# EAGLE design vera-module (EAGLE 7.7.0)

## Sheet 1 of 2
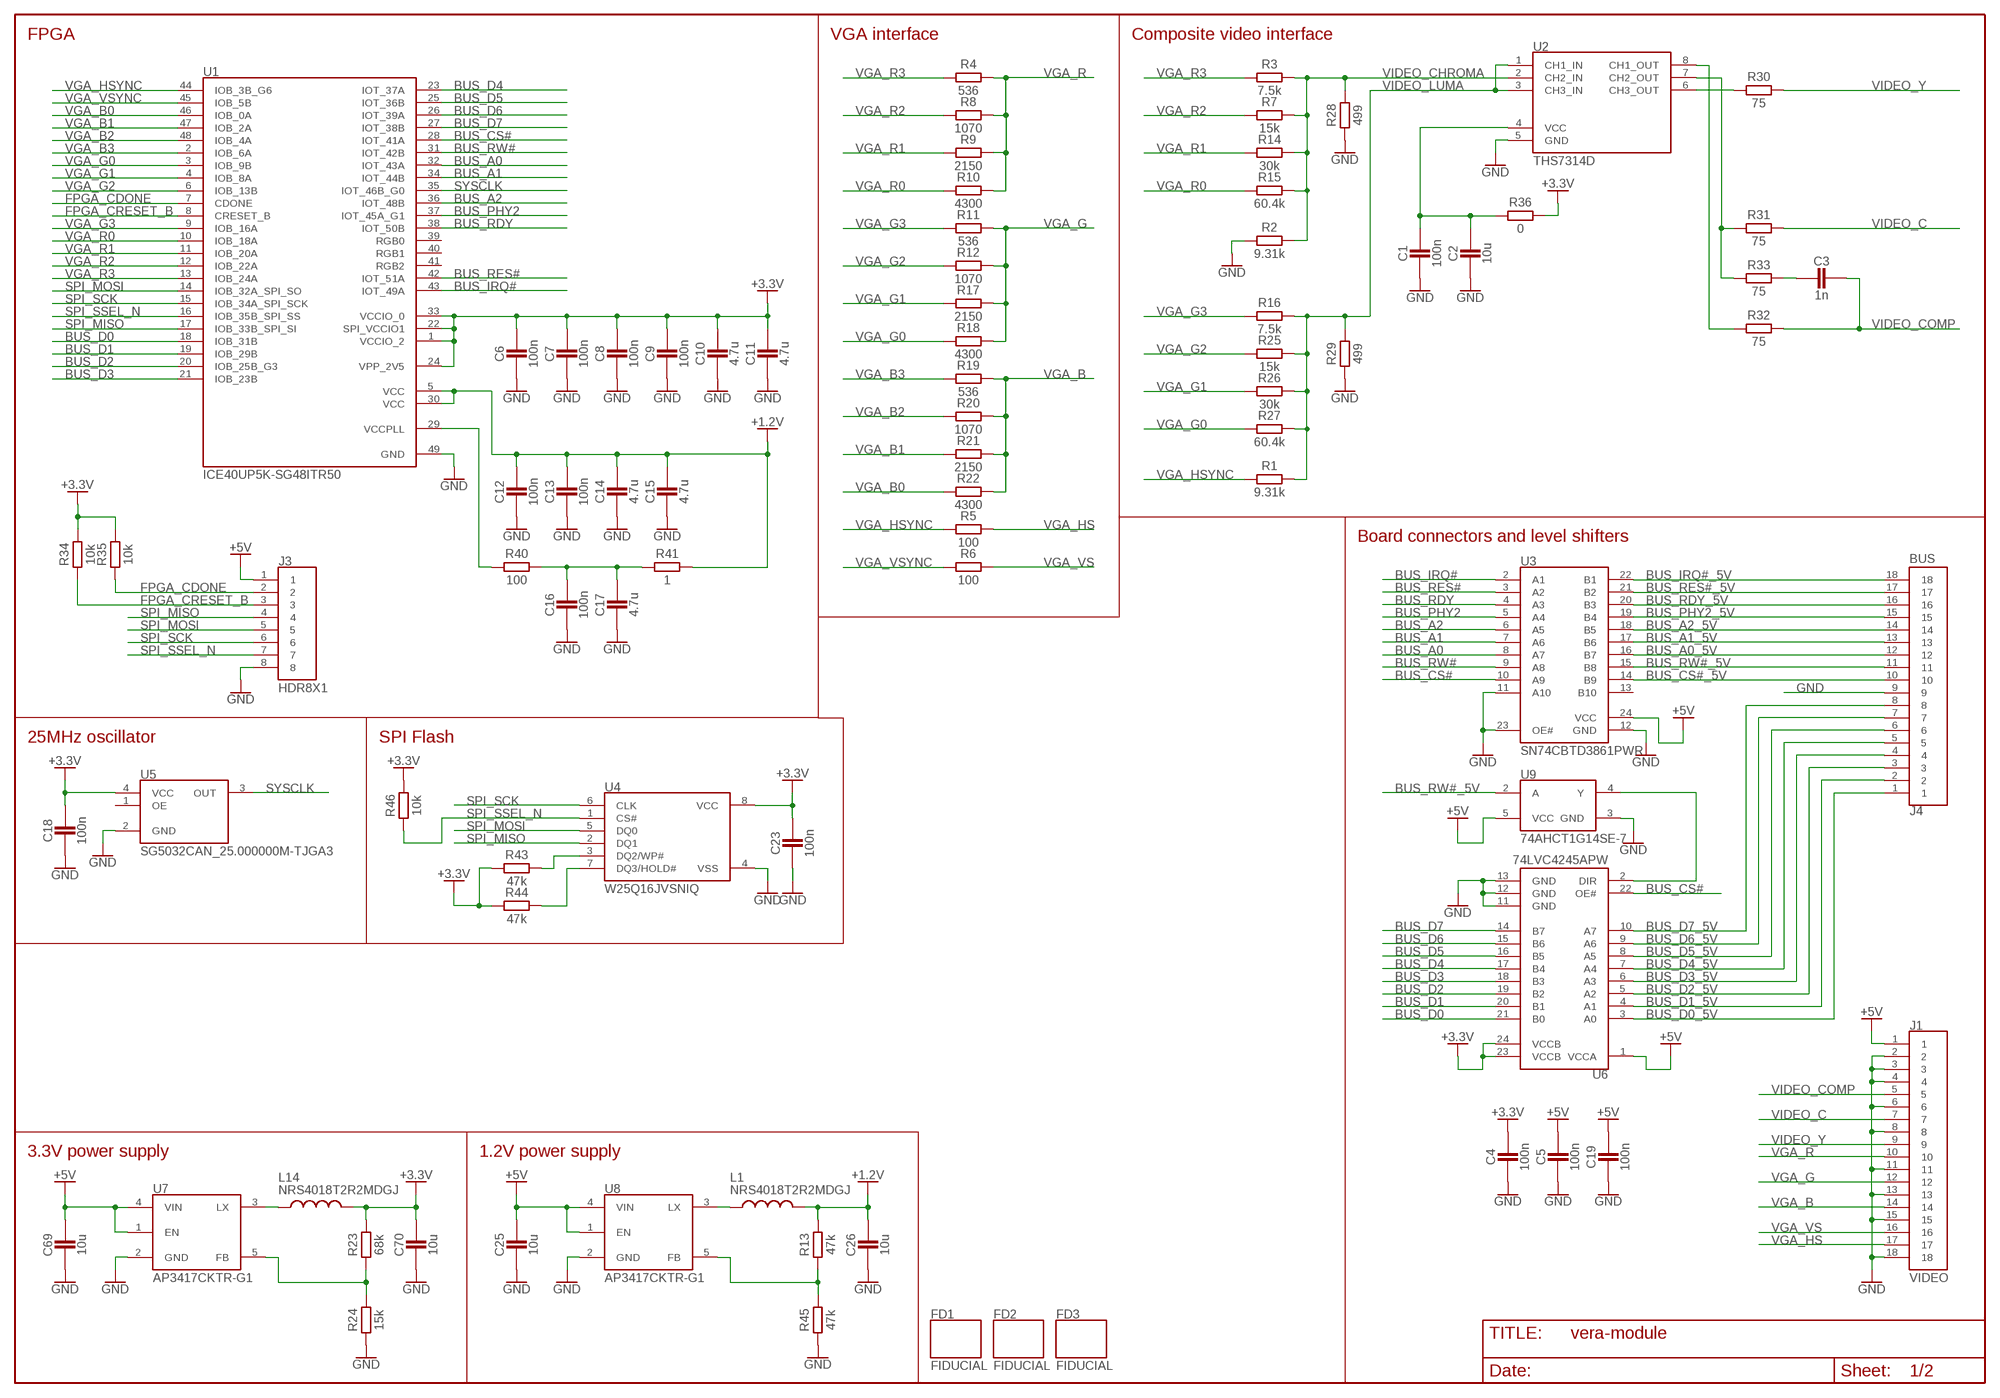
[diagram p0: schematic, sheet 1]

### Parts
C1  100n  CAPACITOR0603  [C0603]
C2  10u  CAPACITOR0805  [C0805]
C3  1n  CAPACITOR0603  [C0603]
C4  100n  CAPACITOR0603  [C0603]
C5  100n  CAPACITOR0603  [C0603]
C6  100n  CAPACITOR0603  [C0603]
C7  100n  CAPACITOR0603  [C0603]
C8  100n  CAPACITOR0603  [C0603]
C9  100n  CAPACITOR0603  [C0603]
C10  4.7u  CAPACITOR0603  [C0603]
C11  4.7u  CAPACITOR0603  [C0603]
C12  100n  CAPACITOR0603  [C0603]
C13  100n  CAPACITOR0603  [C0603]
C14  4.7u  CAPACITOR0603  [C0603]
C15  4.7u  CAPACITOR0603  [C0603]
C16  100n  CAPACITOR0603  [C0603]
C17  4.7u  CAPACITOR0603  [C0603]
C18  100n  CAPACITOR0603  [C0603]
C19  100n  CAPACITOR0603  [C0603]
C23  100n  CAPACITOR0603  [C0603]
C25  10u  CAPACITOR0805  [C0805]
C26  10u  CAPACITOR0805  [C0805]
C69  10u  CAPACITOR0805  [C0805]
C70  10u  CAPACITOR0805  [C0805]
FD1  FIDUCIAL  [FIDUCIAL]
FD2  FIDUCIAL  [FIDUCIAL]
FD3  FIDUCIAL  [FIDUCIAL]
J1  VIDEO  HDR18X1  [HDR18X1]
J3  HDR8X1  [HDR8X1]
J4  BUS  HDR18X1  [HDR18X1]
L1  NRS4018T2R2MDGJ  INDUCTORNRS4018  [NRS4018]
L14  NRS4018T2R2MDGJ  INDUCTORNRS4018  [NRS4018]
R1  9.31k  RESISTOR0603  [R0603]
R2  9.31k  RESISTOR0603  [R0603]
R3  7.5k  RESISTOR0603  [R0603]
R4  536  RESISTOR0603  [R0603]
R5  100  RESISTOR0603  [R0603]
R6  100  RESISTOR0603  [R0603]
R7  15k  RESISTOR0603  [R0603]
R8  1070  RESISTOR0603  [R0603]
R9  2150  RESISTOR0603  [R0603]
R10  4300  RESISTOR0603  [R0603]
R11  536  RESISTOR0603  [R0603]
R12  1070  RESISTOR0603  [R0603]
R13  47k  RESISTOR0603  [R0603]
R14  30k  RESISTOR0603  [R0603]
R15  60.4k  RESISTOR0603  [R0603]
R16  7.5k  RESISTOR0603  [R0603]
R17  2150  RESISTOR0603  [R0603]
R18  4300  RESISTOR0603  [R0603]
R19  536  RESISTOR0603  [R0603]
R20  1070  RESISTOR0603  [R0603]
R21  2150  RESISTOR0603  [R0603]
R22  4300  RESISTOR0603  [R0603]
R23  68k  RESISTOR0603  [R0603]
R24  15k  RESISTOR0603  [R0603]
R25  15k  RESISTOR0603  [R0603]
R26  30k  RESISTOR0603  [R0603]
R27  60.4k  RESISTOR0603  [R0603]
R28  499  RESISTOR0603  [R0603]
R29  499  RESISTOR0603  [R0603]
R30  75  RESISTOR0603  [R0603]
R31  75  RESISTOR0603  [R0603]
R32  75  RESISTOR0603  [R0603]
R33  75  RESISTOR0603  [R0603]
R34  10k  RESISTOR0603  [R0603]
R35  10k  RESISTOR0603  [R0603]
R36  0  RESISTOR0603  [R0603]
R40  100  RESISTOR0603  [R0603]
R41  1  RESISTOR0603  [R0603]
R43  47k  RESISTOR0603  [R0603]
R44  47k  RESISTOR0603  [R0603]
R45  47k  RESISTOR0603  [R0603]
R46  10k  RESISTOR0603  [R0603]
U1  ICE40UP5K-SG48ITR50  [QFN-48]
U2  THS7314D  [SOIC-8]
U3  SN74CBTD3861PWR  [TSSOP-24]
U4  W25Q16JVSNIQ  QSPI_FLASHSOIC8  [SOIC-8]
U5  SG5032CAN_25.000000M-TJGA3  SG5032CAN_40.000000M-TJGA3  [SG5032]
U6  74LVC4245APW  [TSSOP-24]
U7  AP3417CKTR-G1  [SOT-23-5]
U8  AP3417CKTR-G1  [SOT-23-5]
U9  74AHCT1G14SE-7  [TSSOP-5]

### Nets
+1.2V: C12.2 C13.2 C14.2 C15.2 C26.2 L1.2 R13.2 R41.2 U1.5(VCC) U1.30(VCC)
+3.3V: C4.2 C6.2 C7.2 C8.2 C9.2 C10.2 C11.2 C18.2 C23.2 C70.2 L14.2 R23.2 R34.1 R35.1 R36.2 R43.1 R44.1 R46.1 U1.1(VCCIO_2) U1.22(SPI_VCCIO1) U1.24(VPP_2V5) U1.33(VCCIO_0) U4.8(VCC) U5.4(VCC) U6.23(VCCB) U6.24(VCCB)
+5V [5V]: C5.2 C19.2 C25.2 C69.2 J1.1 J3.1 U3.24(VCC) U6.1(VCCA) U7.1(EN) U7.4(VIN) U8.1(EN) U8.4(VIN) U9.5(VCC) ; also sheet 2
BUS_A0: U1.32(IOT_43A) U3.8(A7)
BUS_A0_5V: J4.12 U3.16(B7)
BUS_A1: U1.34(IOT_44B) U3.7(A6)
BUS_A1_5V: J4.13 U3.17(B6)
BUS_A2: U1.36(IOT_48B) U3.6(A5)
BUS_A2_5V: J4.14 U3.18(B5)
BUS_CS#: U1.28(IOT_41A) U3.10(A9) U6.22(OE#)
BUS_CS#_5V: J4.10 U3.14(B9)
BUS_D0: U1.18(IOB_31B) U6.21(B0)
BUS_D0_5V: J4.1 U6.3(A0)
BUS_D1: U1.19(IOB_29B) U6.20(B1)
BUS_D1_5V: J4.2 U6.4(A1)
BUS_D2: U1.20(IOB_25B_G3) U6.19(B2)
BUS_D2_5V: J4.3 U6.5(A2)
BUS_D3: U1.21(IOB_23B) U6.18(B3)
BUS_D3_5V: J4.4 U6.6(A3)
BUS_D4: U1.23(IOT_37A) U6.17(B4)
BUS_D4_5V: J4.5 U6.7(A4)
BUS_D5: U1.25(IOT_36B) U6.16(B5)
BUS_D5_5V: J4.6 U6.8(A5)
BUS_D6: U1.26(IOT_39A) U6.15(B6)
BUS_D6_5V: J4.7 U6.9(A6)
BUS_D7: U1.27(IOT_38B) U6.14(B7)
BUS_D7_5V: J4.8 U6.10(A7)
BUS_IRQ#: U1.43(IOT_49A) U3.2(A1)
BUS_IRQ#_5V: J4.18 U3.22(B1)
BUS_PHY2: U1.37(IOT_45A_G1) U3.5(A4)
BUS_PHY2_5V: J4.15 U3.19(B4)
BUS_RDY: U1.38(IOT_50B) U3.4(A3)
BUS_RDY_5V: J4.16 U3.20(B3)
BUS_RES#: U1.42(IOT_51A) U3.3(A2)
BUS_RES#_5V: J4.17 U3.21(B2)
BUS_RW#: U1.31(IOT_42B) U3.9(A8)
BUS_RW#_5V: J4.11 U3.15(B8) U9.2(A)
FPGA_CDONE: J3.2 R35.2 U1.7(CDONE) ; also sheet 2
FPGA_CRESET_B: J3.3 R34.2 U1.8(CRESET_B) ; also sheet 2
GND: C1.1 C2.1 C4.1 C5.1 C6.1 C7.1 C8.1 C9.1 C10.1 C11.1 C12.1 C13.1 C14.1 C15.1 C16.1 C17.1 C18.1 C19.1 C23.1 C25.1 C26.1 C69.1 C70.1 J1.2 J1.3 J1.4 J1.6 J1.8 J1.11 J1.13 J1.15 J1.18 J3.8 J4.9 R2.1 R24.1 R28.2 R29.2 R45.1 U1.49(GND) U2.5(GND) U3.11(A10) U3.12(GND) U3.23(OE#) U4.4(VSS) U5.2(GND) U6.11(GND) U6.12(GND) U6.13(GND) U7.2(GND) U8.2(GND) U9.3(GND) ; also sheet 2
N$1: R30.1 U2.6(CH3_OUT)
N$2: R31.1 R33.1 U2.7(CH2_OUT)
N$4: R32.1 U2.8(CH1_OUT)
N$6: C3.1 R33.2
N$7: R23.1 R24.2 U7.5(FB)
N$8: U6.2(DIR) U9.4(Y)
N$9: C16.2 C17.2 R40.2 R41.1
N$14: R43.2 U4.3(DQ2/WP#)
N$15: R13.1 R45.2 U8.5(FB)
N$19: R44.2 U4.7(DQ3/HOLD#)
N$20: L1.1 U8.3(LX)
N$23: L14.1 U7.3(LX)
N$29: C1.2 C2.2 R36.1 U2.4(VCC)
N$44: R40.1 U1.29(VCCPLL)
SPI_MISO: J3.4 U1.17(IOB_33B_SPI_SI) U4.2(DQ1) ; also sheet 2
SPI_MOSI: J3.5 U1.14(IOB_32A_SPI_SO) U4.5(DQ0) ; also sheet 2
SPI_SCK: J3.6 U1.15(IOB_34A_SPI_SCK) U4.6(CLK) ; also sheet 2
SPI_SSEL_N: J3.7 R46.2 U1.16(IOB_35B_SPI_SS) U4.1(CS#) ; also sheet 2
SYSCLK: U1.35(IOT_46B_G0) U5.3(OUT)
VGA_B: J1.14 R19.2 R20.2 R21.2 R22.2
VGA_B0: R22.1 U1.46(IOB_0A)
VGA_B1: R21.1 U1.47(IOB_2A)
VGA_B2: R20.1 U1.48(IOB_4A)
VGA_B3: R19.1 U1.2(IOB_6A)
VGA_G: J1.12 R11.2 R12.2 R17.2 R18.2
VGA_G0: R18.1 R27.1 U1.3(IOB_9B)
VGA_G1: R17.1 R26.1 U1.4(IOB_8A)
VGA_G2: R12.1 R25.1 U1.6(IOB_13B)
VGA_G3: R11.1 R16.1 U1.9(IOB_16A)
VGA_HS: J1.17 R5.2
VGA_HSYNC: R1.1 R5.1 U1.44(IOB_3B_G6)
VGA_R: J1.10 R4.2 R8.2 R9.2 R10.2
VGA_R0: R10.1 R15.1 U1.10(IOB_18A)
VGA_R1: R9.1 R14.1 U1.11(IOB_20A)
VGA_R2: R7.1 R8.1 U1.12(IOB_22A)
VGA_R3: R3.1 R4.1 U1.13(IOB_24A)
VGA_VS: J1.16 R6.2
VGA_VSYNC: R6.1 U1.45(IOB_5B)
VIDEO_C: J1.7 R31.2
VIDEO_CHROMA: R2.2 R3.2 R7.2 R14.2 R15.2 R28.1 U2.2(CH2_IN)
VIDEO_COMP: C3.2 J1.5 R32.2
VIDEO_LUMA: R1.2 R16.2 R25.2 R26.2 R27.2 R29.1 U2.1(CH1_IN) U2.3(CH3_IN)
VIDEO_Y: J1.9 R30.2
Unconnected: U1.39(RGB0) U1.40(RGB1) U1.41(RGB2) U3.13(B10) U5.1(OE)

### Notes on the sheet
- FPGA | VGA interface | Composite video interface
- Board connectors and level shifters
- 25MHz oscillator | SPI Flash
- 3.3V power supply | 1.2V power supply

## Sheet 2 of 2
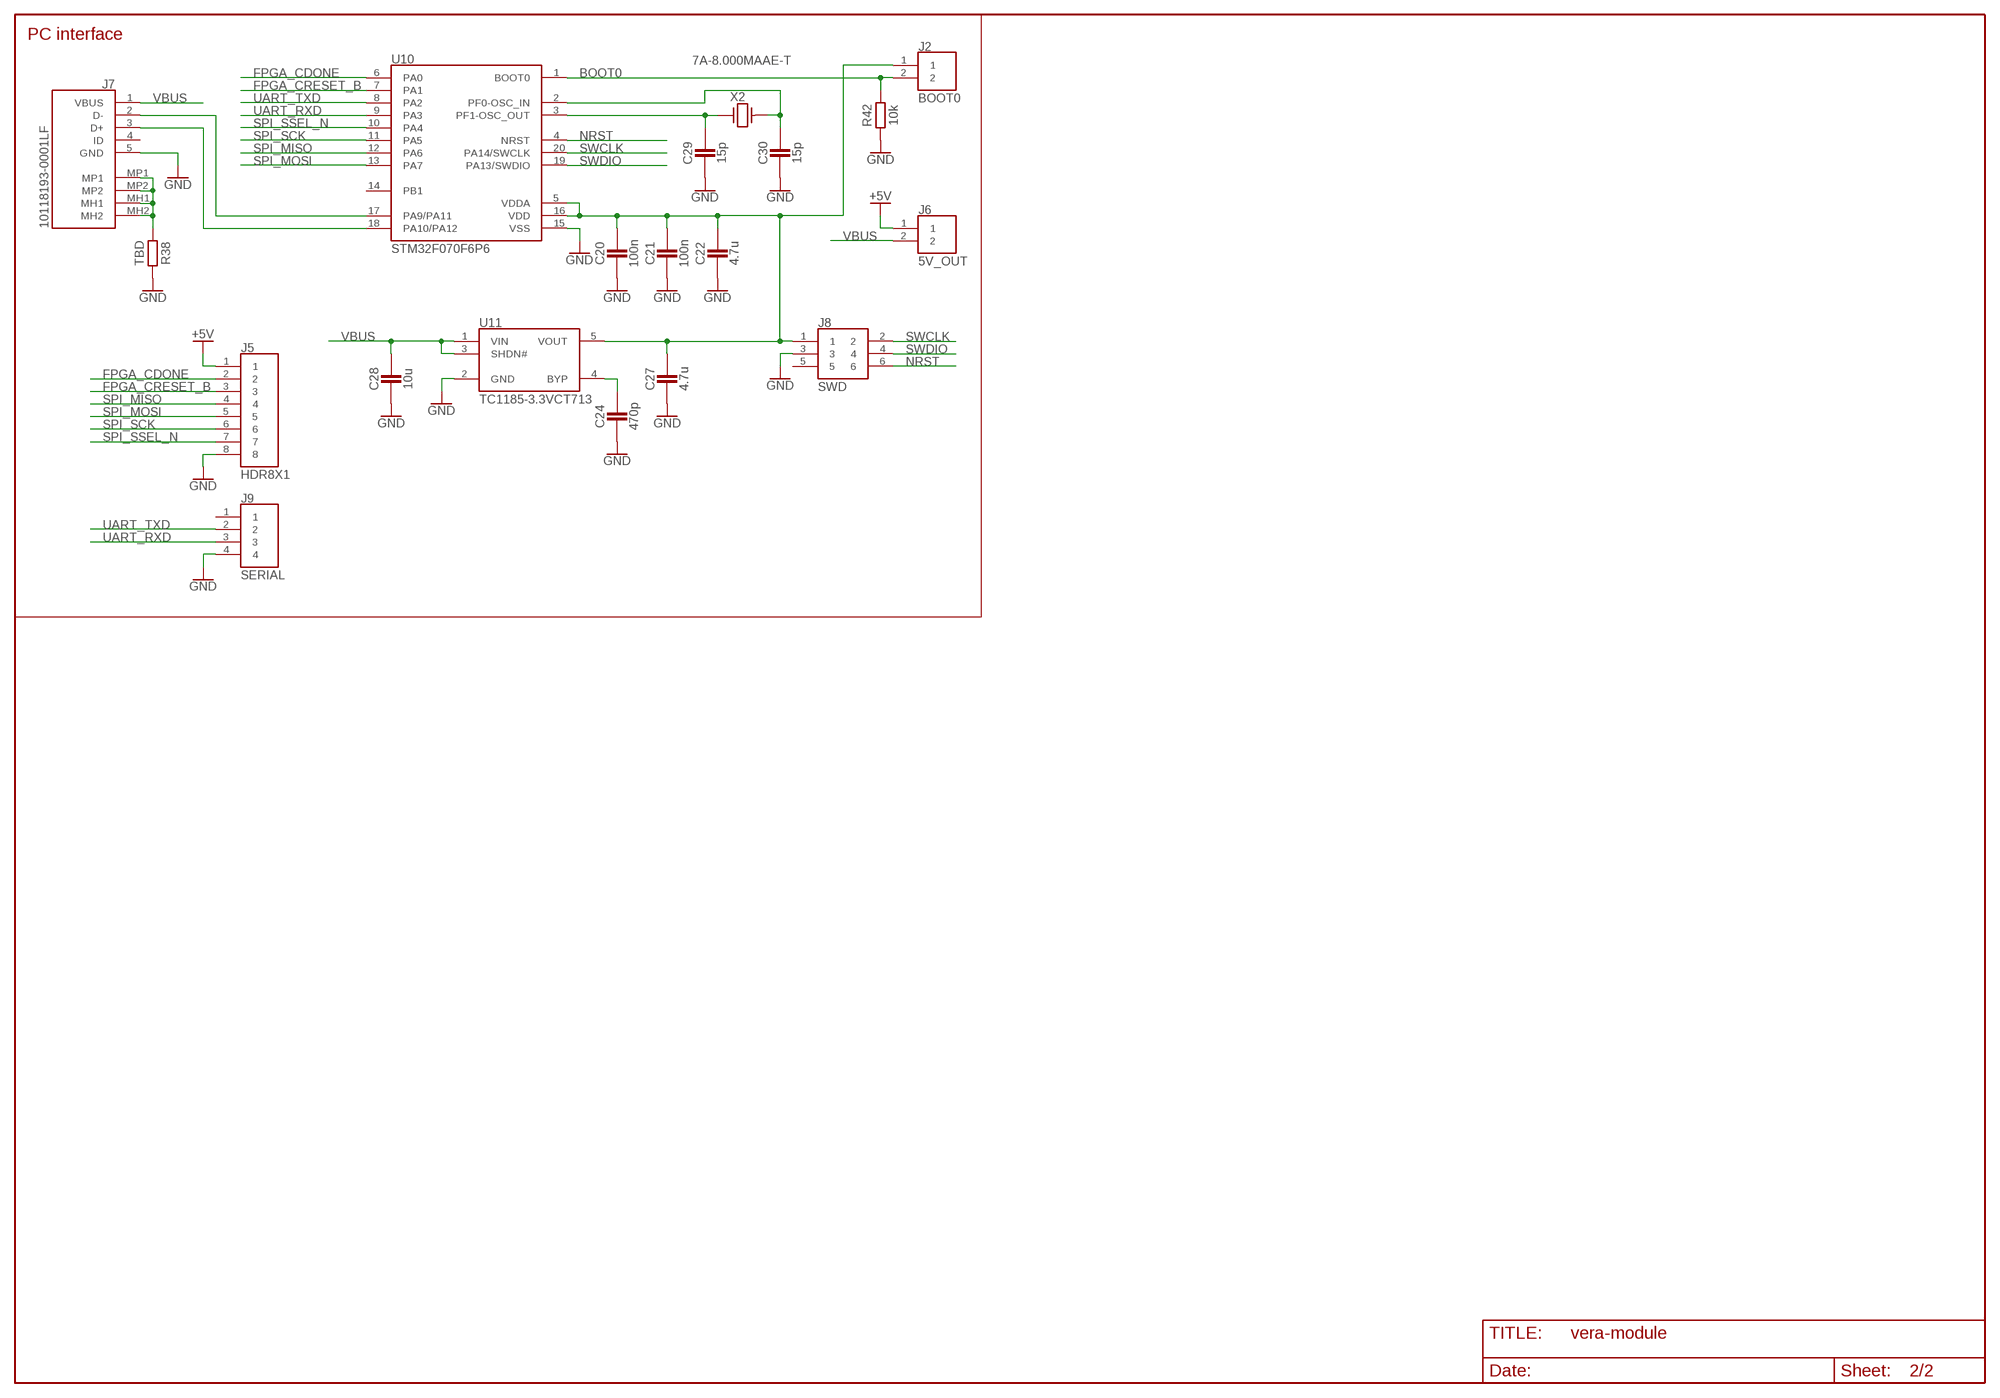
[diagram p1: schematic, sheet 2]

### Parts
C20  100n  CAPACITOR0603  [C0603]
C21  100n  CAPACITOR0603  [C0603]
C22  4.7u  CAPACITOR0603  [C0603]
C24  470p  CAPACITOR0603  [C0603]
C27  4.7u  CAPACITOR0603  [C0603]
C28  10u  CAPACITOR0805  [C0805]
C29  15p  CAPACITOR0603  [C0603]
C30  15p  CAPACITOR0603  [C0603]
J2  BOOT0  HDR2X1  [HDR2X1]
J5  HDR8X1  [HDR8X1]
J6  5V_OUT  HDR2X1  [HDR2X1]
J7  10118193-0001LF  [10118193-0001LF]
J8  SWD  HDR2X3  [HDR2X3]
J9  SERIAL  HDR4X1  [HDR4X1]
R38  TBD  RESISTOR0603  [R0603]
R42  10k  RESISTOR0603  [R0603]
U10  STM32F070F6P6  [TSSOP-20]
U11  TC1185-3.3VCT713  [SOT-23-5]
X2  7A-8.000MAAE-T  XTAL2_5X3.2  [XTAL2_5X3.2]

### Nets
+5V [5V]: J5.1 J6.1 ; also sheet 1
BOOT0: J2.2 R42.2 U10.1(BOOT0)
FPGA_CDONE: J5.2 U10.6(PA0) ; also sheet 1
FPGA_CRESET_B: J5.3 U10.7(PA1) ; also sheet 1
GND: C20.1 C21.1 C22.1 C24.1 C27.1 C28.1 C29.1 C30.1 J5.8 J7.5(GND) J8.3 J9.4 R38.1 R42.1 U10.15(VSS) U11.2(GND) ; also sheet 1
N$3: C29.2 U10.3(PF1-OSC_OUT) X2.1
N$5: C20.2 C21.2 C22.2 C27.2 J2.1 J8.1 U10.5(VDDA) U10.16(VDD) U11.5(VOUT)
N$10: C24.2 U11.4(BYP)
N$11: C30.2 U10.2(PF0-OSC_IN) X2.2
N$12: J7.2(D-) U10.17(PA9/PA11)
N$13: J7.3(D+) U10.18(PA10/PA12)
N$48: J7.MH1 J7.MH2 J7.MP1 J7.MP2 R38.2
NRST: J8.6 U10.4(NRST)
SPI_MISO: J5.4 U10.12(PA6) ; also sheet 1
SPI_MOSI: J5.5 U10.13(PA7) ; also sheet 1
SPI_SCK: J5.6 U10.11(PA5) ; also sheet 1
SPI_SSEL_N: J5.7 U10.10(PA4) ; also sheet 1
SWCLK: J8.2 U10.20(PA14/SWCLK)
SWDIO: J8.4 U10.19(PA13/SWDIO)
UART_RXD: J9.3 U10.9(PA3)
UART_TXD: J9.2 U10.8(PA2)
VBUS [5V]: C28.2 J6.2 J7.1(VBUS) U11.1(VIN) U11.3(SHDN#)
Unconnected: J7.4(ID) J8.5 J9.1 U10.14(PB1)

### Notes on the sheet
- PC interface

## Library data of the parts
C1-C30 C69 C70 = rcl:CAPACITOR
FD1-FD3 = misc:FIDUCIAL
J1 J4 = connectors:HDR18X1
J2 J6 = connectors:HDR2X1
J3 J5 = connectors:HDR8X1
J7 = connectors:10118193-0001LF
J8 = connectors:HDR2X3
J9 = connectors:HDR4X1
L1 L14 = rcl:INDUCTOR
R1-R36 R38 R40-R46 = rcl:RESISTOR
U1 = integrated_circuits:ICE40UP5K-SG48ITR50: Lattice ICE40 5K LE FPGA
U2 = integrated_circuits:THS7314D
U3 = integrated_circuits:SN74CBTD3861PWR
U4 = integrated_circuits:QSPI_FLASH
U5 = integrated_circuits:SG5032CAN_40.000000M-TJGA3: Epson 40 MHz 3.3V Oscillator +/- 50ppm
U6 = integrated_circuits:74LVC4245APW
U7 U8 = integrated_circuits:AP3417CKTR-G1
U9 = integrated_circuits:74AHCT1G14SE-7
U10 = integrated_circuits:STM32F070F6P6: ARM Cortex M0 with USB 32KB Flash, 6KB RAM
U11 = integrated_circuits:TC1185-3.3VCT713
X2 = crystals:XTAL2_5X3.2

## Net classes
1 5V: clearance 0.2 mm

## Board
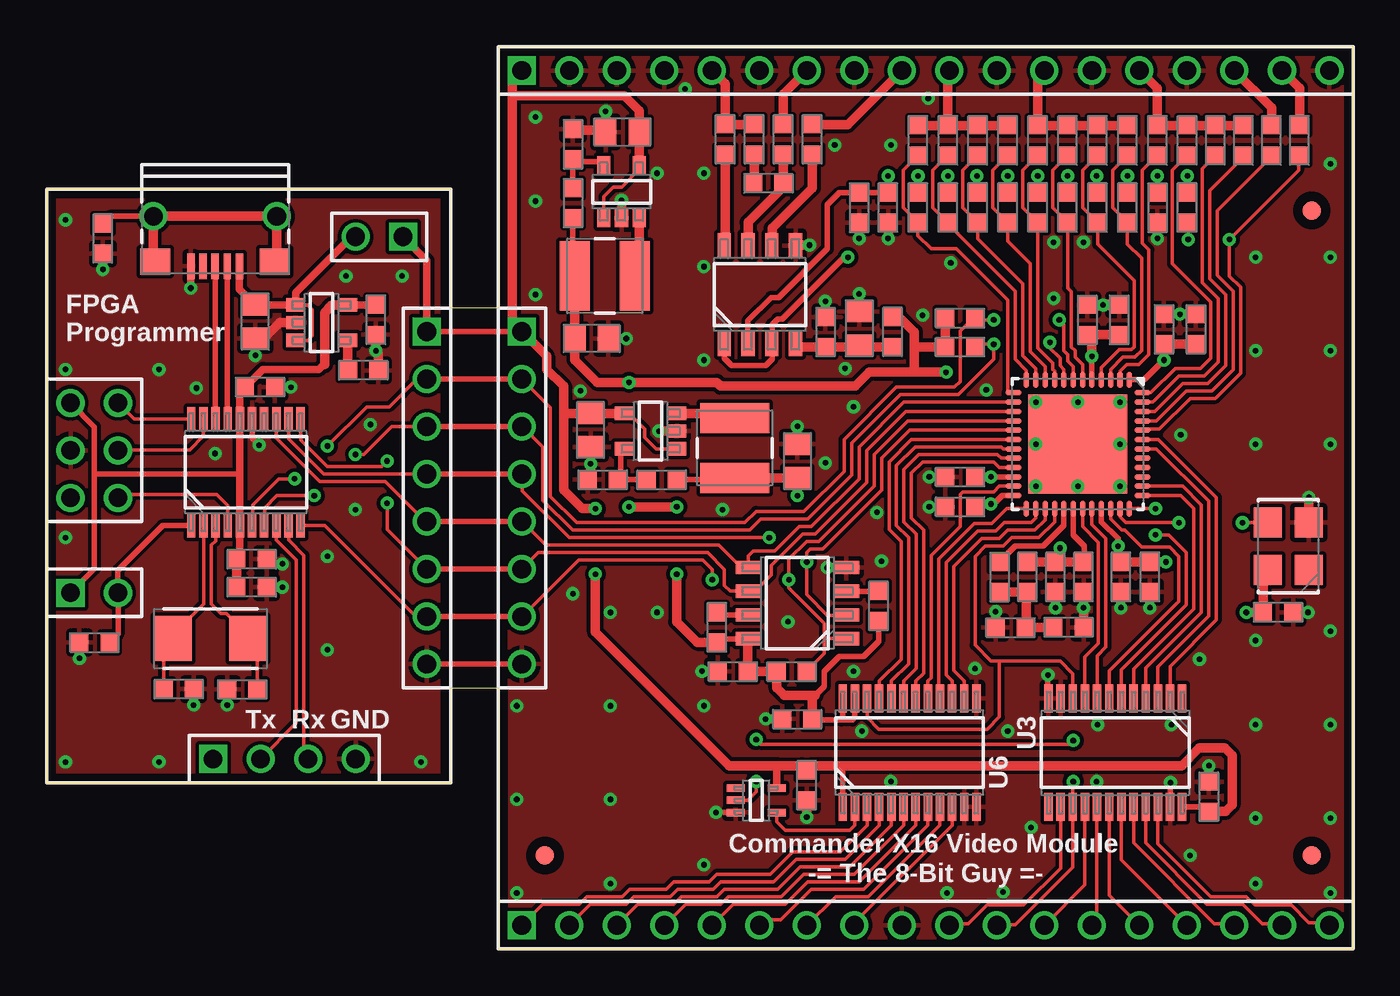
[diagram p2: board, top side]
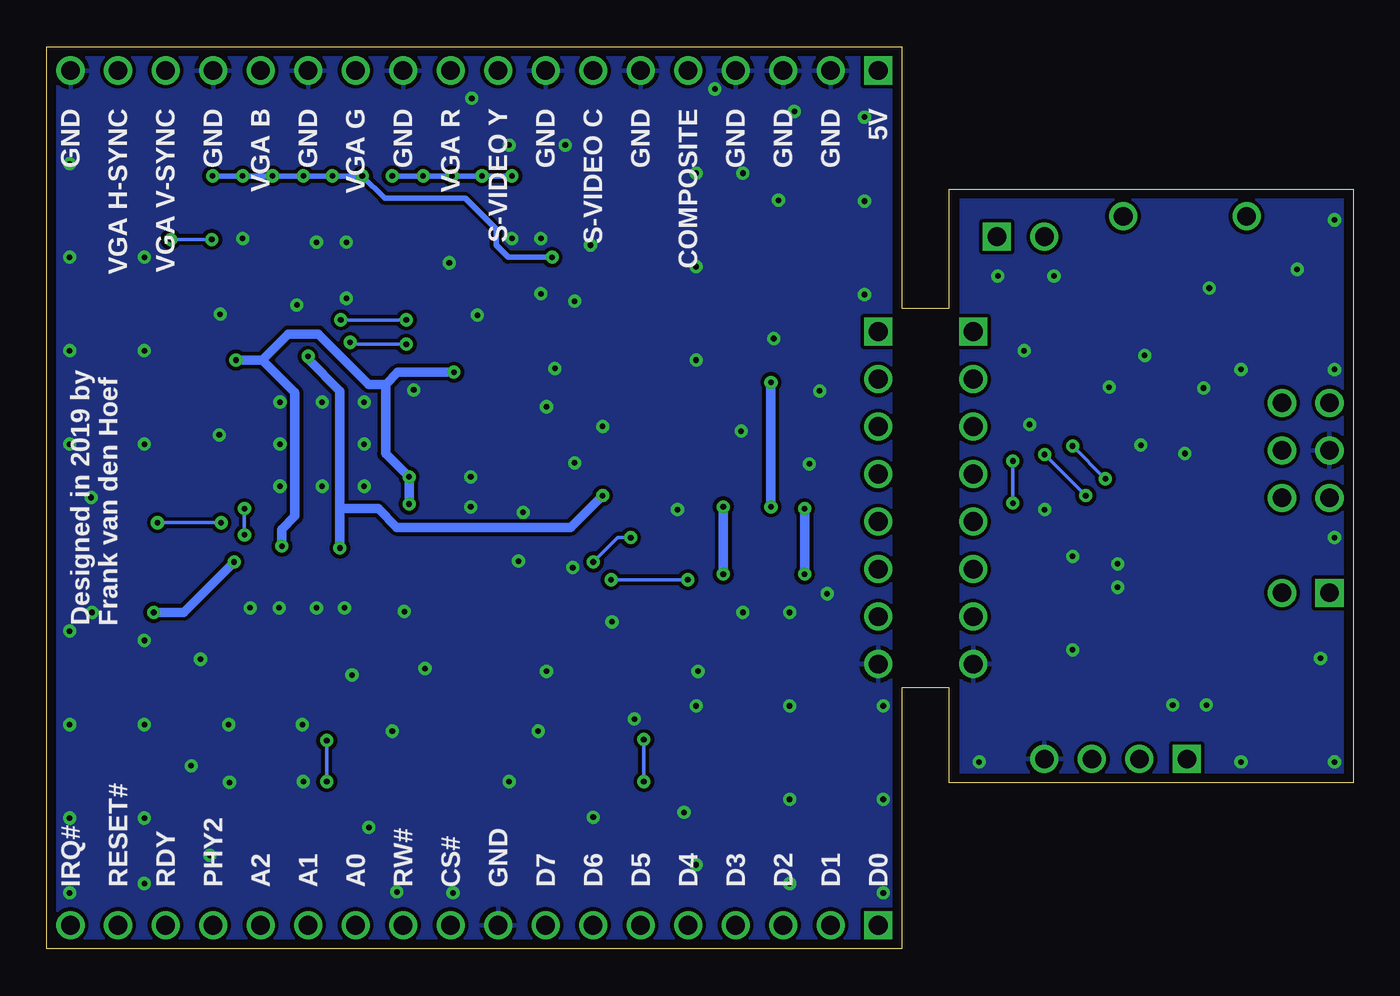
[diagram p3: board, bottom side, seen from below]

Size 69.85 x 48.26 mm. Coordinates in mm from the lower left corner, seen from the top.
Outline: 24.13,0 69.85,0 69.85,48.26 24.13,48.26 24.13,34.29 21.59,34.29 21.59,40.64 0,40.64 0,8.89 21.59,8.89 21.59,13.97 24.13,13.97 24.13,0
Copper layers (1*16): Top 0.035mm / dielectric 1.6mm / Bottom 0.035mm
Design rules "Frank_2-layer *": minimum track width 0.2mm, minimum drill 0.3mm, track to track 0.2mm, track to pad 0.2mm, pad to pad 0.2mm, via to via 0.2mm, smd to smd 0mil, copper to edge 0.5mm, drill to drill 10mil, minimum pad ring 0.2mm, minimum via ring 0.2mm, stop-mask expansion 0.1mm, vias tented up to drill 20mil, thermal gap 10mil
tRestrict: area 52.1,24 to 58.1,30

### Footprints (pad centres in the part's own frame; a part is rotated, then mirrored left to right if it is on the bottom)
C0603 = smd 0.95 x 1: 1 -0.8,0; 2 0.8,0
C0805 = smd 1.15 x 1.45: 1 -0.9,0; 2 0.9,0
FIDUCIAL = smd 1 x 1: FD 0,0
HDR18X1 = drill 1 square: 1 0,21.59 | drill 1: 2 0,19.05; 3 0,16.51; 4 0,13.97; 5 0,11.43; 6 0,8.89; 7 0,6.35; 8 0,3.81; 9 0,1.27; 10 0,-1.27; 11 0,-3.81; 12 0,-6.35; 13 0,-8.89; 14 0,-11.43; 15 0,-13.97; 16 0,-16.51; 17 0,-19.05; 18 0,-21.59
HDR2X1 = drill 1 square: 1 0,1.27 | drill 1: 2 0,-1.27
HDR8X1 = drill 1 square: 1 0,8.89 | drill 1: 2 0,6.35; 3 0,3.81; 4 0,1.27; 5 0,-1.27; 6 0,-3.81; 7 0,-6.35; 8 0,-8.89
10118193-0001LF = smd 0.4 x 1.35: 1 -1.3,4.125; 2 -0.65,4.125; 3 0,4.125; 4 0.65,4.125; 5 1.3,4.125 | drill 1 pad 1.2: MH1 -3.3,1.45; MH2 3.3,1.45 | smd 1.6 x 1.4: MP1 -3.2,3.875; MP2 3.2,3.875
HDR2X3 = drill 1: 1 -1.27,2.54; 2 1.27,2.54; 3 -1.27,0; 4 1.27,0; 5 -1.27,-2.54; 6 1.27,-2.54
HDR4X1 = drill 1 square: 1 0,3.81 | drill 1: 2 0,1.27; 3 0,-1.27; 4 0,-3.81
NRS4018 = smd 1.6 x 3.7: 1 -1.6,0; 2 1.6,0
R0603 = smd 0.95 x 1: 1 -0.8,0; 2 0.8,0
QFN-48 = smd 0.85 x 0.3: 1 -3.45,2.75; 2 -3.45,2.25; 3 -3.45,1.75; 4 -3.45,1.25; 5 -3.45,0.75; 6 -3.45,0.25; 7 -3.45,-0.25; 8 -3.45,-0.75; 9 -3.45,-1.25; 10 -3.45,-1.75; 11 -3.45,-2.25; 12 -3.45,-2.75; 25 3.45,-2.75; 26 3.45,-2.25; 27 3.45,-1.75; 28 3.45,-1.25; 29 3.45,-0.75; 30 3.45,-0.25; 31 3.45,0.25; 32 3.45,0.75; 33 3.45,1.25; 34 3.45,1.75; 35 3.45,2.25; 36 3.45,2.75 | smd 0.3 x 0.85: 13 -2.75,-3.45; 14 -2.25,-3.45; 15 -1.75,-3.45; 16 -1.25,-3.45; 17 -0.75,-3.45; 18 -0.25,-3.45; 19 0.25,-3.45; 20 0.75,-3.45; 21 1.25,-3.45; 22 1.75,-3.45; 23 2.25,-3.45; 24 2.75,-3.45; 37 2.75,3.45; 38 2.25,3.45; 39 1.75,3.45; 40 1.25,3.45; 41 0.75,3.45; 42 0.25,3.45; 43 -0.25,3.45; 44 -0.75,3.45; 45 -1.25,3.45; 46 -1.75,3.45; 47 -2.25,3.45; 48 -2.75,3.45 | smd 5.3 x 5.3: 49 0,0
SOIC-8 = smd 1.35 x 0.71: 1 -2.625,1.905; 2 -2.625,0.635; 3 -2.625,-0.635; 4 -2.625,-1.905; 5 2.625,-1.905; 6 2.625,-0.635; 7 2.625,0.635; 8 2.625,1.905
TSSOP-24 = smd 1.5 x 0.45: 1 -2.9,3.575; 2 -2.9,2.925; 3 -2.9,2.275; 4 -2.9,1.625; 5 -2.9,0.975; 6 -2.9,0.325; 7 -2.9,-0.325; 8 -2.9,-0.975; 9 -2.9,-1.625; 10 -2.9,-2.275; 11 -2.9,-2.925; 12 -2.9,-3.575; 13 2.9,-3.575; 14 2.9,-2.925; 15 2.9,-2.275; 16 2.9,-1.625; 17 2.9,-0.975; 18 2.9,-0.325; 19 2.9,0.325; 20 2.9,0.975; 21 2.9,1.625; 22 2.9,2.275; 23 2.9,2.925; 24 2.9,3.575
SG5032 = smd 1.6 x 1.5: 1 -1.27,-1.1; 2 1.27,-1.1; 3 1.27,1.1; 4 -1.27,1.1
SOT-23-5 = smd 1 x 0.71: 1 -1.4,0.95; 2 -1.4,0; 3 -1.4,-0.95; 4 1.4,-0.95; 5 1.4,0.95
TSSOP-5 = smd 0.95 x 0.4: 1 -1.1,0.65; 2 -1.1,0; 3 -1.1,-0.65; 4 1.1,-0.65; 5 1.1,0.65
TSSOP-20 = smd 1.3 x 0.45: 1 -2.85,2.925; 2 -2.85,2.275; 3 -2.85,1.625; 4 -2.85,0.975; 5 -2.85,0.325; 6 -2.85,-0.325; 7 -2.85,-0.975; 8 -2.85,-1.625; 9 -2.85,-2.275; 10 -2.85,-2.925; 11 2.85,-2.925; 12 2.85,-2.275; 13 2.85,-1.625; 14 2.85,-0.975; 15 2.85,-0.325; 16 2.85,0.325; 17 2.85,0.975; 18 2.85,1.625; 19 2.85,2.275; 20 2.85,2.925
XTAL2_5X3.2 = smd 2 x 2.4: 1 -2,0; 2 2,0

### Placement (x,y rotation side)
C1  41.63,33 270 top
C2  43.43,33.2 270 top
C3  37.83,43.3 90 top
C4  40.13,12.3 0 top
C5  62.13,8.15 270 top
C6  59.73,33.15 270 top
C7  48.83,25.25 0 top
C8  48.83,23.65 0 top
C9  57.43,19.9 90 top
C10  58.98,19.9 90 top
C11  61.43,33.15 270 top
C12  55.63,33.65 270 top
C13  55.43,19.9 90 top
C14  53.93,19.9 90 top
C15  57.33,33.65 270 top
C16  54.63,17.2 180 top
C17  51.53,17.2 0 top
C18  65.83,18 180 top
C19  40.63,8.75 90 top
C20  10.95,20.85 180 top
C21  11.4,30.05 180 top
C22  10.95,19.35 180 top
C23  36.68,14.85 0 top
C24  16.92,30.95 180 top
C25  29.08,27.75 90 top
C26  40.13,26.1 270 top
C27  17.6,33.65 90 top
C28  11.15,33.55 90 top
C29  10.46,13.89 0 top
C30  7.05,13.9 180 top
C69  30.78,43.7 0 top
C70  29.13,32.65 180 top
FD1  26.63,5 0 top
FD2  67.63,5 0 top
FD3  67.63,39.5 0 top
J1  46.99,46.99 90 top
J2  2.54,19.05 90 top
J3  25.4,24.13 0 top
J4  46.99,1.27 90 top
J5  20.32,24.13 0 top
J6  17.78,38.1 270 top
J7  9,40.64 180 top
J8  2.54,26.67 0 top
J9  12.7,10.16 90 top
L1  36.78,26.8 270 top
L14  29.83,36 180 top
R1  60.98,39.65 90 top
R2  44.98,39.65 90 top
R3  46.58,39.65 90 top
R4  46.58,43.25 90 top
R5  66.98,43.25 90 top
R6  65.48,43.25 90 top
R7  48.18,39.65 90 top
R8  48.18,43.25 90 top
R9  49.78,43.25 90 top
R10  51.38,43.25 90 top
R11  52.98,43.25 90 top
R12  54.58,43.25 90 top
R13  32.88,25.1 0 top
R14  49.78,39.65 90 top
R15  51.38,39.65 90 top
R16  52.98,39.65 90 top
R17  56.18,43.25 90 top
R18  57.78,43.25 90 top
R19  59.38,43.25 90 top
R20  60.98,43.25 90 top
R21  62.48,43.25 90 top
R22  63.98,43.25 90 top
R23  28.13,39.9 270 top
R24  28.13,43.05 270 top
R25  54.58,39.65 90 top
R26  56.18,39.65 90 top
R27  57.78,39.65 90 top
R28  1.2k  [R0603]  43.43,39.65 270 top
R29  1.2k  [R0603]  59.38,39.65 270 top
R30  40.93,43.3 90 top
R31  39.38,43.3 90 top
R32  36.28,43.3 90 top
R33  0  [R0603]  38.58,40.95 180 top
R34  48.83,32.2 0 top
R35  48.83,33.75 0 top
R36  45.23,33 90 top
R38  3,38 90 top
R40  50.93,19.9 270 top
R41  52.43,19.9 90 top
R42  2.55,16.4 0 top
R43  44.48,18.35 90 top
R44  35.83,17.2 90 top
R45  29.73,25.1 0 top
R46  39.83,14.85 0 top
U1  55.13,27 270 top
U2  38.13,35 90 top
U3  57.13,10.5 270 top
U4  40.13,18.5 180 top
U5  66.38,21.55 90 top
U6  46.13,10.5 90 top
U7  30.73,40.5 90 top
U8  32.28,27.7 180 top
U9  37.93,7.95 0 top
U10  10.65,25.5 90 top
U11  14.7,33.5 0 top
X2  8.75,16.6 180 top

### Tracks (layer width: path | path; a pad name or v marks a point on that pad's centre or on a via)
+1.2V  (via drill 0.3)
  Top 0.3: U1.5 v55.88,31.7 | U1.30 54.88,22.15 55.48,21.55 55.48,20.75 | R13.2 35.23,25.1
  Top 0.5: v55.88,31.7 55.88,32.6 C12.2 C15.2 | R41.2 C14.2 | C14.2 C13.2 55.48,20.75 | C14.2 54.18,20.95 v54.18,21.45 | 35.23,25.1 35.33,25.2 L1.2 C26.2 v40.13,24.25
  Bottom 0.5: v55.88,31.7 55.88,31.55 54.18,29.85 54.18,23.55 | 54.18,23.55 v54.18,21.45 | 54.18,23.55 52.13,23.55 51.13,22.55 41.83,22.55 v40.13,24.25
+3.3V  (via drill 0.3)
  Top 0.3: U1.22 v50.48,25.25 | U1.24 51.08,24.25 50.63,23.8 v50.48,23.8 | U1.33 56.38,22.85 57.28,21.95 v57.28,21.55 | U1.1 58.68,30.45 v59.73,31.5 | 37.48,16.57 36,16.57 R44.1 35.63,16.4 | R23.2 28.13,37.55 | R43.1 44.48,16.45 43.68,15.65 42.38,15.65 41.58,14.85 41.58,14.05 41.08,13.55 | U6.23 43.2,12.38 43.08,12.25 42.48,12.25 | U6.24 42.55,12.32 42.48,12.25 | 42.48,12.25 40.98,12.25 C4.2
  Top 0.5: C7.2 v50.48,25.25 | C8.2 49.78,23.8 v50.48,23.8 | v57.28,21.55 57.28,20.85 C9.2 C10.2 v59.83,20.7 | C11.2 C6.2 v59.73,31.5 | U4.8 37.48,16.57 C23.2 R46.1 39.03,13.95 39.43,13.55 40.83,13.55 | 28.13,37.55 28.23,37.45 L14.2 C70.2 28.23,31.5 29.43,30.3 v31.13,30.3 35.83,30.3 36.03,30.1 43.23,30.1 43.98,30.85 46.38,30.85 | 65.26,20.3 U5.4 65.03,20.03 C18.2 v64.13,18 | R36.2 45.58,33.8 46.38,33 46.38,32.2 | 46.38,32.2 46.38,30.85 | R35.1 R34.1 46.38,32.2 | 46.38,30.85 v48.08,30.85 | v31.13,23.65 v33.68,23.65 | v33.68,20.05 33.68,17.5 34.78,16.4 R44.1 | 41.08,13.55 40.83,13.55 | 40.83,13.55 40.93,13.45 C4.2
  Bottom 0.5: v50.48,23.8 v50.48,25.25 51.73,26.5 51.73,30.2 | v59.73,31.5 58.33,31.5 | 58.33,31.5 56.58,29.75 56.58,23.15 57.28,22.45 v57.28,21.55 | v48.08,30.85 51.08,30.85 51.73,30.2 | 51.73,30.2 52.63,30.2 55.33,32.9 56.93,32.9 58.33,31.5 | v33.68,23.65 v33.68,20.05 | v59.83,20.7 62.53,18 v64.13,18 | v31.13,23.65 v31.13,30.3
+5V  (via drill 0.3)
  Top 0.2: U7.1 29.78,40.25 30.28,40.75 30.73,40.75 31.68,41.7 U7.4 | U8.1 32.58,26.75 31.98,27.35 31.98,27.8 31.13,28.65 U8.4
  Top 0.3: U3.24 61.88,7.6 C5.2 | U6.1 42.55,9.68 42.68,9.8 | J5.1 J3.1
  Top 0.4: U9.5 39.03,9.8 | J6.1 20.32,36.83 J5.1
  Top 0.5: U7.4 C69.2 31.68,44.85 30.88,45.65 24.88,45.65 | U8.4 C25.2 27.63,28.65 | 24.88,45.65 24.88,46.47 J1.1 | 24.88,45.65 24.88,33.54 J3.1 26.73,31.7 26.73,31 27.63,30.1 27.63,28.65 | C5.2 63.03,7.35 63.38,7.7 63.38,10.35 62.98,10.75 61.63,10.75 60.68,9.8 42.68,9.8 40.88,9.8 C19.2 40.38,9.8 39.03,9.8 36.48,9.8 29.33,16.95 v29.33,20.05 | 27.63,28.65 27.63,24.55 28.63,23.55 v29.33,23.55
  Bottom 0.5: v29.33,23.55 v29.33,20.05
BOOT0
  Top 0.3: R42.2 3.81,16.86 J2.2 3.8,20.25 6.2,22.65 U10.1
BUS_A0
  Top 0.2: U1.32 55.88,22.7 56.63,21.95 56.63,16.15 56.16,15.68 U3.8
BUS_A0_5V
  Top 0.2: U3.16 55.51,3.42 53.38,1.3 53.37,1.3 J4.12
BUS_A1
  Top 0.2: U1.34 56.88,23 57.48,22.4 57.63,22.4 58.53,21.5 60.03,21.5 60.53,21 60.53,18.6 56.8,14.88 U3.7
BUS_A1_5V
  Top 0.2: J4.13 55.88,1.3 56.13,1.55 56.13,7.58 U3.17
BUS_A2  (via drill 0.3)
  Top 0.2: U1.36 v59.28,23.55 | v59.28,22.15 59.98,22.15 60.93,21.2 60.93,18.4 57.45,14.93 U3.6
  Bottom 0.2: v59.28,23.55 v59.28,22.15
BUS_A2_5V
  Top 0.2: U3.18 56.8,2.88 58.38,1.3 58.39,1.3 J4.14
BUS_CS#
  Top 0.2: U1.28 53.88,22.85 53.03,22 51.58,22 51.13,21.55 50.18,21.55 49.63,21 49.63,16.25 50.48,15.4 50.93,15.4 | 50.93,15.4 54.18,15.4 54.85,14.72 U3.10 | U6.22 43.85,12.38 44.48,11.75 50.28,11.75 50.93,12.4 50.93,15.4
BUS_CS#_5V
  Top 0.2: U3.14 54.2,4.33 52.23,2.35 50.28,2.35 49.28,1.35 48.34,1.35 J4.10
BUS_D0
  Top 0.2: U1.18 46.23,27.25 45.03,26.05 45.03,22.45 45.68,21.8 45.68,15.5 44.51,14.32 U6.21
BUS_D0_5V
  Top 0.2: J4.1 26.53,2.4 28.48,2.4 28.88,2.8 30.78,2.8 31.18,3.2 33.13,3.2 33.53,3.6 35.43,3.6 35.83,4 38.68,4 39.88,5.2 42.43,5.2 43.85,6.62 U6.3
BUS_D1
  Top 0.2: U1.19 51.13,26.75 51.03,26.85 46.43,26.85 45.43,25.85 45.43,22.65 46.08,22 46.08,15.25 45.16,14.32 U6.20
BUS_D1_5V
  Top 0.2: J4.2 29.07,2.4 30.98,2.4 31.38,2.8 33.33,2.8 33.73,3.2 35.63,3.2 36.03,3.6 38.88,3.6 40.08,4.8 42.68,4.8 44.51,6.62 U6.4
BUS_D2
  Top 0.2: U1.20 51.03,26.25 50.83,26.45 46.63,26.45 45.83,25.65 45.83,22.85 46.48,22.2 46.48,15 45.8,14.32 U6.19
BUS_D2_5V
  Top 0.2: J4.3 31.61,2.4 33.53,2.4 33.93,2.8 35.83,2.8 36.23,3.2 39.08,3.2 40.28,4.4 42.93,4.4 45.16,6.62 U6.5
BUS_D3
  Top 0.2: U1.21 50.93,25.75 50.63,26.05 46.83,26.05 46.23,25.45 46.23,23.05 46.88,22.4 46.88,14.75 46.45,14.32 U6.18
BUS_D3_5V
  Top 0.2: J4.4 34.15,2.4 36.03,2.4 36.43,2.8 39.28,2.8 40.48,4 43.18,4 45.8,6.62 U6.6
BUS_D4
  Top 0.2: U1.23 50.93,24.75 50.63,24.45 48.98,24.45 48.83,24.3 48.83,22.6 47.28,21.05 47.28,14.5 47.1,14.32 U6.17
BUS_D4_5V
  Top 0.2: J4.5 36.69,2.4 39.48,2.4 40.68,3.6 43.43,3.6 46.45,6.62 U6.7
BUS_D5
  Top 0.2: U1.25 51.33,23.55 50.53,22.75 49.58,22.75 47.68,20.85 47.68,13.47 U6.16
BUS_D5_5V
  Top 0.2: J4.6 38.38,1.55 39.23,1.55 40.88,3.2 43.68,3.2 47.1,6.62 U6.8
BUS_D6
  Top 0.2: U1.26 52.88,23.05 52.63,22.8 51.18,22.8 50.73,22.35 49.77,22.35 48.08,20.66 48.08,14.65 48.41,14.32 U6.15
BUS_D6_5V
  Top 0.2: U6.9 47.76,6.62 43.93,2.8 42.17,2.8 J4.7
BUS_D7
  Top 0.2: U1.27 53.38,22.95 52.83,22.4 51.38,22.4 50.93,21.95 49.98,21.95 48.48,20.45 48.48,14.9 49.05,14.32 U6.14
BUS_D7_5V
  Top 0.2: U6.10 48.41,6.62 43.18,1.4 J4.8
BUS_IRQ#
  Top 0.2: U1.43 59.43,27.25 62.53,24.15 62.53,17.6 60.05,15.12 U3.2
BUS_IRQ#_5V
  Top 0.2: U3.22 59.41,5.62 62.23,2.8 64.13,2.8 64.58,2.35 66.53,2.35 67.48,1.4 68.45,1.4 J4.18
BUS_PHY2
  Top 0.2: U1.37 60.63,24.25 61.33,23.55 61.33,18.2 58.1,14.97 U3.5
BUS_PHY2_5V
  Top 0.2: J4.15 57.45,4.78 U3.19
BUS_RDY
  Top 0.2: U1.38 60.73,24.75 61.73,23.75 61.73,18 58.76,15.03 U3.4
BUS_RDY_5V
  Top 0.2: U3.20 58.1,5.67 62.43,1.35 63.42,1.35 J4.16
BUS_RES#
  Top 0.2: U1.42 59.33,26.75 62.13,23.95 62.13,17.8 59.41,15.07 U3.3
BUS_RES#_5V
  Top 0.2: U3.21 58.76,5.67 62.03,2.4 63.93,2.4 64.98,1.35 65.96,1.35 J4.17
BUS_RW#
  Top 0.2: U1.31 55.38,22.6 56.23,21.75 56.23,16.35 55.51,15.62 U3.9
BUS_RW#_5V  (via drill 0.3)
  Top 0.2: J4.11 50.83,1.3 51.78,1.3 54.85,4.38 U3.15 54.85,8.93 v54.88,8.95 | U9.2 37.48,7.95 37.93,8.4 v37.93,8.95 | v37.93,11.2 38.18,10.95 54.68,10.95 v54.88,11.15
  Bottom 0.2: v54.88,8.95 v54.88,11.15 | v37.93,8.95 v37.93,11.2
FPGA_CDONE  (via drill 0.3)
  Top 0.2: U1.7 54.88,31.15 54.58,31.45 54.58,31.8 54.38,32 54.38,33.4 v54.13,33.65 | J3.2 26.93,28.95 26.93,24.2 28.33,22.8 37.33,22.8 37.93,23.4 40.48,23.4 42.63,25.55 42.63,27.25 45.43,30.05 48.53,30.05 48.83,30.35 48.83,33.05 49.53,33.75 R35.2 49.73,33.65 v50.63,33.65 | J5.2 19.78,30.48 18.3,29 17.1,29 v15,26.9 | v13.25,25.15 12.4,25.15 11,23.75 11,22.68 U10.6
  Top 0.3: J5.2 J3.2
  Bottom 0.2: v54.13,33.65 v50.63,33.65 | v15,26.9 v13.25,25.15
FPGA_CRESET_B  (via drill 0.3)
  Top 0.2: U1.8 54.38,31 54.18,31.2 54.18,31.6 53.63,32.15 v53.63,32.45 | J3.3 25.44,27.94 26.53,26.85 26.53,24 28.13,22.4 37.58,22.4 38.18,23 40.68,23 43.03,25.35 43.03,27.05 45.63,29.65 48.73,29.65 50.63,31.55 v50.63,32.35 49.78,32.35 R34.2 | v16.5,26.45 16.95,26.45 18.45,27.95 J5.3 | v14.3,24.25 12.3,24.25 11.65,23.6 11.65,22.68 U10.7
  Top 0.3: J5.3 J3.3
  Bottom 0.2: v53.63,32.45 53.53,32.35 v50.63,32.35 | v16.5,26.45 v14.3,24.25
GND  (via drill 0.3)
  Top 0.2: U3.12 53.53,13.43
  Top 0.3: U3.23 60.05,8.88 v60.08,8.9 | R24.1 28.28,43.7 | 53.53,13.43 v53.53,14.65 | U9.3 v35.78,7.3 | J5.8 J3.8 | U10.15 10.97,27.32 v11.35,26.95
  Top 0.4: J7.5 v7.7,35.35 | C20.1 12,20.6 v12.6,20.6
  Top 0.5: U7.2 v30.73,40.05 | v29.88,44.8 C69.1 29.68,43.7 29.58,43.8 28.38,43.8 28.28,43.7 | C70.1 v30.98,32.65 | U8.2 v32.73,27.7 | C25.1 v29.08,25.95 29.08,25.25 R45.1 | C26.1 v40.13,27.95 | C7.1 v47.18,25.25 | C8.1 v47.18,23.65 | C13.1 v55.43,18.25 55.43,17.3 55.38,17.25 C16.1 | C9.1 v57.43,18.25 | C10.1 v58.98,18.25 | C17.1 v50.73,18.05 | C11.1 v60.58,33.95 C6.1 | C14.1 v53.93,18.25 | C23.1 v35.03,14.85 | U4.4 v41.73,20.4 | v52.88,29.25 v55.13,29.25 | v55.13,29.25 v57.38,29.25 v57.38,27 v57.38,24.75 v55.13,24.75 | v55.13,24.75 v52.88,24.75 | U1.49 v52.88,27 | U1.49 v55.13,29.25 | v55.13,24.75 U1.49 | R2.1 v44.98,38 | R28.2 v43.43,38 | R29.2 v59.38,38 | U2.5 40.06,37.65 v40.78,37.65 | C1.1 v41.63,34.65 | C2.1 v43.43,35.05 | U5.2 v67.48,24.15 | C5.1 v62.13,9.8 | C18.1 v67.43,18 | C19.1 v40.63,7.05 40.68,7 | C4.1 38.48,12.3 | v11.15,31.75 C28.1 11.6,32.65 12.45,33.5 U11.2 | C27.1 v17.6,32 17.72,31.88 C24.1 | C21.1 v13.05,30.05 | C22.1 v12.6,19.35 | R38.1 v3,36.35 | R42.1 v1.75,15.55 | C30.1 v7.85,13.05 | C29.1 v9.66,13.06 v9.65,13.05
  Top 0.6: C12.1 v56.48,34.45 C15.1
  other vias: 39.63,17.5 28.13,19 25.13,13 30.13,13 35.13,13 30.13,18 25.13,8 30.13,8 35.13,4.5 30.13,3.5 25.13,3 32.63,18 38.43,12.3 43.58,11.65 51.38,11.65 45.13,8.95 56.18,12 60.13,12 64.63,12 68.63,12 64.63,7 68.63,7 68.63,3 64.63,3.5 61.13,5 68.63,17 64.63,16.5 61.63,15.5 68.63,27 68.63,32 68.63,37 68.63,42 64.63,27 64.63,32 64.63,37 60.63,27.5 48.13,3 51.13,3.05 52.63,6.5 56.13,8.95 49.63,15 43.13,14.85 44.63,20.75 44.38,23.35 43.13,29 41.63,26 36.13,23.5 28.53,29.85 42.68,31.05 35.13,31.5 35.13,36.5 35.13,41.5 34.13,46 26.13,35 26.13,40 26.13,44.5 32.63,41.5 42.13,43 45.13,43 47.13,45.5 53.83,37.8 53.83,34.8 55.43,37.8 48.33,36.7 46.83,33.9 50.23,29.9 17.3,28.05 16.5,23.5 6,31 8,30 19,36 16,36 1,39 1,31 15,16 15,21 1,10 6,10 20,10 1,22 9,26.5
  pour Bottom: 24.73,0 24.73,48.26 69.85,48.26 69.85,0
  pour Top: 24.73,0 24.73,48.26 69.85,48.26 69.85,0
  pour Top: 0,40.64 20.95,40.64 20.95,8.89 0,8.89
  pour Bottom: 0,40.64 0,8.89 20.95,8.89 20.95,40.64
N$1
  Top 0.5: R30.1 40.93,40.7 38.78,38.55 38.78,37.64 U2.6
N$2
  Top 0.5: R31.1 R33.1 39.38,40.75 37.49,38.87 U2.7
N$3
  Top 0.2: U10.3 9.03,21.82 8.8,21.6 8.8,18.45 9.3,17.95 9.6,17.95 10.75,16.8 X2.1 11.26,16.09 C29.2
N$4
  Top 0.5: R32.1 36.28,37.68 U2.8
N$5
  Top 0.3: J8.1 2.55,27.93 2.55,25.4 | 2.55,25.4 10.32,25.4 | 2.55,25.4 2.55,20.33 J2.1
  Top 0.4: C27.2 U11.5 | 14.85,31.3 14.55,31 11.55,31 C21.2 10.32,29.77 U10.16 10.32,25.4 U10.5 10.32,21.02 C20.2
  Top 0.5: U11.5 15.25,34.45 14.85,34.05 14.85,31.3 14.85,31.25 | C20.2 C22.2
N$6
  Top 0.5: C3.1 37.83,41 R33.2
N$7
  Top 0.3: R23.1 R24.2 28.28,42.1 29.78,42.1 U7.5
N$8
  Top 0.2: U6.2 43.2,6.62 42.93,6.35 39.48,6.35 39.03,6.8 U9.4
N$9
  Top 0.5: R40.2 R41.1 52.38,19.05 52.38,17.25 C17.2 C16.2
N$10
  Top 0.5: U11.4 16.1,30.97 C24.2
N$11
  Top 0.2: U10.2 8.4,22.62 8.4,18.45 6.75,16.8 X2.2 6.25,16.1 C30.2
N$12
  Top 0.3: J7.2 9.65,28.38 U10.17
N$13
  Top 0.3: J7.3 9,28.38 U10.18
N$14
  Top 0.3: U4.3 44.47,19.14 R43.2
N$15
  Top 0.3: R13.1 R45.2 30.68,25.25 30.68,26.75 U8.5
N$19
  Top 0.3: U4.7 35.97,17.86 R44.2
N$20
  Top 0.5: U8.3 36.78,28.65 L1.1
N$23
  Top 0.5: U7.3 31.68,36.25 L14.1
N$29
  Top 0.5: U2.4 40.21,32.2 C1.2 43.33,32.2 C2.2 43.53,32.2 R36.1
N$44
  Top 0.3: U1.29 54.38,22.65 53.28,21.55 51.78,21.55 R40.1
N$48
  Top 0.3: J7.MH2 3.39,39.19 R38.2
  Top 0.5: J7.MP2 5.7,36.87 J7.MH2 J7.MH1 12.3,36.87 J7.MP1
NRST
  Top 0.2: U10.4 9.68,23.73 9.1,24.3 3.98,24.3 J8.6
SPI_MISO  (via drill 0.3)
  Top 0.2: U4.2 42.74,17.85 41.73,17.85 40.63,18.95 v40.63,20.7 40.63,21.2 40.83,21.4 41.48,21.4 44.63,24.55 44.63,26.25 46.13,27.75 U1.17 | J3.4 25.43,25.4 25.43,24.5 27.93,22 v38.63,22 | J5.4 14.8,25.4 12.93,27.27 U10.12
  Top 0.3: J5.4 J3.4
  Bottom 0.2: v38.63,22 39.33,22 v40.63,20.7
SPI_MOSI
  Top 0.2: U4.5 | U4.5 37.51,21.02 37.78,21.3 38.93,21.3 40.23,22.6 40.88,22.6 43.43,25.15 43.43,26.85 45.83,29.25 U1.14 | J3.5 25.42,22.86 26.68,21.6 35.93,21.6 37.13,20.4 37.13,20.41 U4.5 | J5.5 20.25,22.85 18.1,25 14.6,25 12.28,27.32 U10.13
  Top 0.3: J5.5 J3.5
SPI_SCK  (via drill 0.3)
  Top 0.2: 37.57,19.2 U4.6 | U1.15 45.93,28.75 43.83,26.65 43.83,24.95 41.08,22.2 40.43,22.2 38.73,20.5 38.73,20 37.87,19.14 U4.6 | J3.6 26.28,21.2 35.33,21.2 36.23,20.3 36.23,19.45 36.53,19.15 37.49,19.15 U4.6 | U10.11 13.57,27.23 15,25.8 17.9,25.8 v18.2,26.1 | v18.2,23.85 18.2,22.44 J5.6
  Top 0.3: J5.6 J3.6
  Bottom 0.2: v18.2,26.1 v18.2,23.85
SPI_SSEL_N  (via drill 0.3)
  Top 0.2: 41.58,16.6 41.58,17.4 39.68,19.3 v39.68,19.75 39.68,20.85 40.63,21.8 41.28,21.8 44.23,24.75 44.23,26.45 46.03,28.25 U1.16 | 42.78,16.57 U4.1 41.58,16.6 | R46.2 41.58,15.8 41.58,16.6 | J3.7 28.43,20.8 35.08,20.8 35.58,20.3 v35.58,19.75 | U10.10 14.85,22.65 19.7,17.8 20.3,17.8 J5.7
  Top 0.3: J5.7 J3.7
  Bottom 0.2: v35.58,19.75 v39.68,19.75
SWCLK
  Top 0.2: U10.20 4.67,28.35 J8.2
SWDIO
  Top 0.2: U10.19 8.38,27.43 7.65,26.7 3.84,26.7 J8.4
SYSCLK  (via drill 0.3)
  Top 0.2: U1.35 57.38,23.1 57.68,22.8 v60.53,22.8 | U5.3 65.26,22.8 v63.93,22.8
  Bottom 0.2: v63.93,22.8 v60.53,22.8
UART_RXD
  Top 0.2: U10.9 12.93,21.88 13.75,21.05 13.75,10.38 J9.3
UART_TXD
  Top 0.2: U10.8 12.28,21.88 13.35,20.8 13.35,12.08 J9.2
VBUS
  Top 0.2: U11.1 13.95,34.45 14.2,34.2 14.2,32.8 13.95,32.55 U11.3
  Top 0.4: J6.2 16.3,38.1 13.3,35.1 U11.1 C28.2 | 11.05,34.45 C28.2 | J7.1 10.3,35.3 C28.2
VGA_B
  Top 0.5: R22.2 R21.2 R20.2 R19.2 59.38,46.03 J1.14
VGA_B0
  Top 0.2: U1.46 59.23,28.75 60.73,30.25 62.08,30.25 63.03,31.2 63.03,35 62.18,35.85 62.18,40.55 63.98,42.35 R22.1
VGA_B1
  Top 0.2: U1.47 59.13,29.25 60.53,30.65 61.88,30.65 62.63,31.4 62.63,34.8 61.78,35.65 61.78,41.75 R21.1
VGA_B2
  Top 0.2: U1.48 59.03,29.75 60.33,31.05 61.68,31.05 62.23,31.6 62.23,34.6 60.18,36.65 60.18,41.65 R20.1
VGA_B3
  Top 0.2: U1.2 57.38,30.9 57.73,31.25 58.38,31.25 58.93,31.8 58.93,37.4 58.58,37.75 58.58,41.65 R19.1
VGA_G
  Top 0.5: R18.2 R17.2 R12.2 R11.2 52.98,46.63 J1.12
VGA_G0
  Top 0.2: U1.3 56.88,31 57.53,31.65 58.18,31.65 58.53,32 58.53,36.95 57.78,37.7 R27.1 56.98,39.65 56.98,41.65 R18.1
VGA_G1
  Top 0.2: U1.4 56.38,31.1 57.33,32.05 57.98,32.05 58.13,32.2 58.13,35.75 56.18,37.7 R26.1 55.38,39.65 55.38,41.65 R17.1
VGA_G2
  Top 0.2: U1.6 55.38,31.25 54.98,31.65 54.98,32 54.78,32.2 54.78,35.15 54.58,35.35 R25.1 53.78,39.65 53.78,41.65 R12.1
VGA_G3
  Top 0.2: U1.9 53.88,30.9 53.78,31 53.78,31.35 52.98,32.15 R16.1 52.18,39.65 52.18,41.65 R11.1
VGA_HS
  Top 0.5: R5.2 66.98,46.05 J1.17
VGA_HSYNC  (via drill 0.3)
  Top 0.2: U1.44 58.63,27.8 59.48,27.8 61.13,29.45 62.48,29.45 63.83,30.8 63.83,35.4 63.23,36 v63.23,37.95 66.93,41.65 66.93,42.45 R5.1 | R1.1 61.03,38.8 v61.03,37.95
  Bottom 0.2: v61.03,37.95 v63.23,37.95
VGA_R
  Top 0.5: R4.2 R8.2 | R8.2 R9.2 R10.2 | R8.2 48.18,46.91 J1.10
VGA_R0
  Top 0.2: U1.10 53.38,31.15 52.58,31.95 52.58,36.65 51.38,37.85 R15.1 50.58,39.65 50.58,41.65 R10.1
VGA_R1
  Top 0.2: U1.11 52.88,31.05 52.18,31.75 52.18,35.6 49.78,38 R14.1 48.98,39.65 48.98,41.65 R9.1
VGA_R2
  Top 0.2: U1.12 52.38,30.95 51.78,31.55 51.78,35.2 48.18,38.8 R7.1 47.38,39.65 47.38,41.65 R8.1
VGA_R3
  Top 0.2: 46.58,42.5 R4.1 45.78,41.65 45.78,39.65 R3.1 46.58,38.15 47.28,37.45 48.63,37.45 51.38,34.7 51.38,29.75 U1.13
VGA_VS
  Top 0.5: R6.2 65.48,45.01 J1.16
VGA_VSYNC
  Top 0.2: U1.45 59.33,28.25 60.93,29.85 62.28,29.85 63.43,31 63.43,35.2 62.58,36.05 62.58,39.5 65.48,42.4 R6.1 65.43,42.45
VIDEO_C
  Top 0.5: R31.2 39.38,45.73 J1.7
VIDEO_CHROMA  (via drill 0.3)
  Top 0.3: R15.2 v51.38,41.35 | R14.2 49.73,40.5 v49.73,41.35 | R7.2 v48.18,41.35 | R3.2 v46.58,41.35 | v44.98,41.35 R2.2 R28.1 42.38,40.45 41.73,39.8 41.73,37.45 39.13,34.85 38.73,34.85 37.48,33.6 37.48,32.39 U2.2
  Bottom 0.3: v51.38,41.35 v49.73,41.35 v48.18,41.35 v46.58,41.35 v44.98,41.35
VIDEO_COMP
  Top 0.5: C3.2 R32.2 36.28,46.27 J1.5
VIDEO_LUMA  (via drill 0.3)
  Top 0.3: R16.2 v52.98,41.35 | R25.2 v54.58,41.35 | R26.2 56.13,40.5 v56.13,41.35 | R27.2 v57.78,41.35 | R29.1 v59.38,41.35 | R1.2 v60.98,41.35 | v42.83,37 42.63,37 39.33,33.7 39.08,33.7 38.78,33.4 U2.3 38.78,32.36 38.78,31.55 38.43,31.2 36.63,31.2 36.23,31.61 U2.1
  Bottom 0.3: v60.98,41.35 v59.38,41.35 v57.78,41.35 v56.13,41.35 v54.58,41.35 v52.98,41.35 51.78,40.15 47.48,40.15 45.83,38.5 45.83,37.65 45.18,37 v42.83,37
VIDEO_Y
  Top 0.5: R30.2 42.83,44.1 J1.9

### Text on the board
tPlace: FPGA / Programmer | Tx | Rx | GND | Commander X16 Video Module | -= The 8-Bit Guy =-
bPlace: 5V | GND | GND | GND | COMPOSITE | GND | S-VIDEO C | GND | S-VIDEO Y | VGA R | GND | VGA G | GND | VGA B | GND | VGA V-SYNC | VGA H-SYNC | GND | Designed in 2019 by / Frank van den Hoef | D0 | D1 | D2 | D3 | D4 | D5 | D6 | D7 | GND | CS# | RW# | A0 | A1 | A2 | PHY2 | RDY | RESET# | IRQ#